# EAGLE design screwshield-idea (EAGLE 5.04)
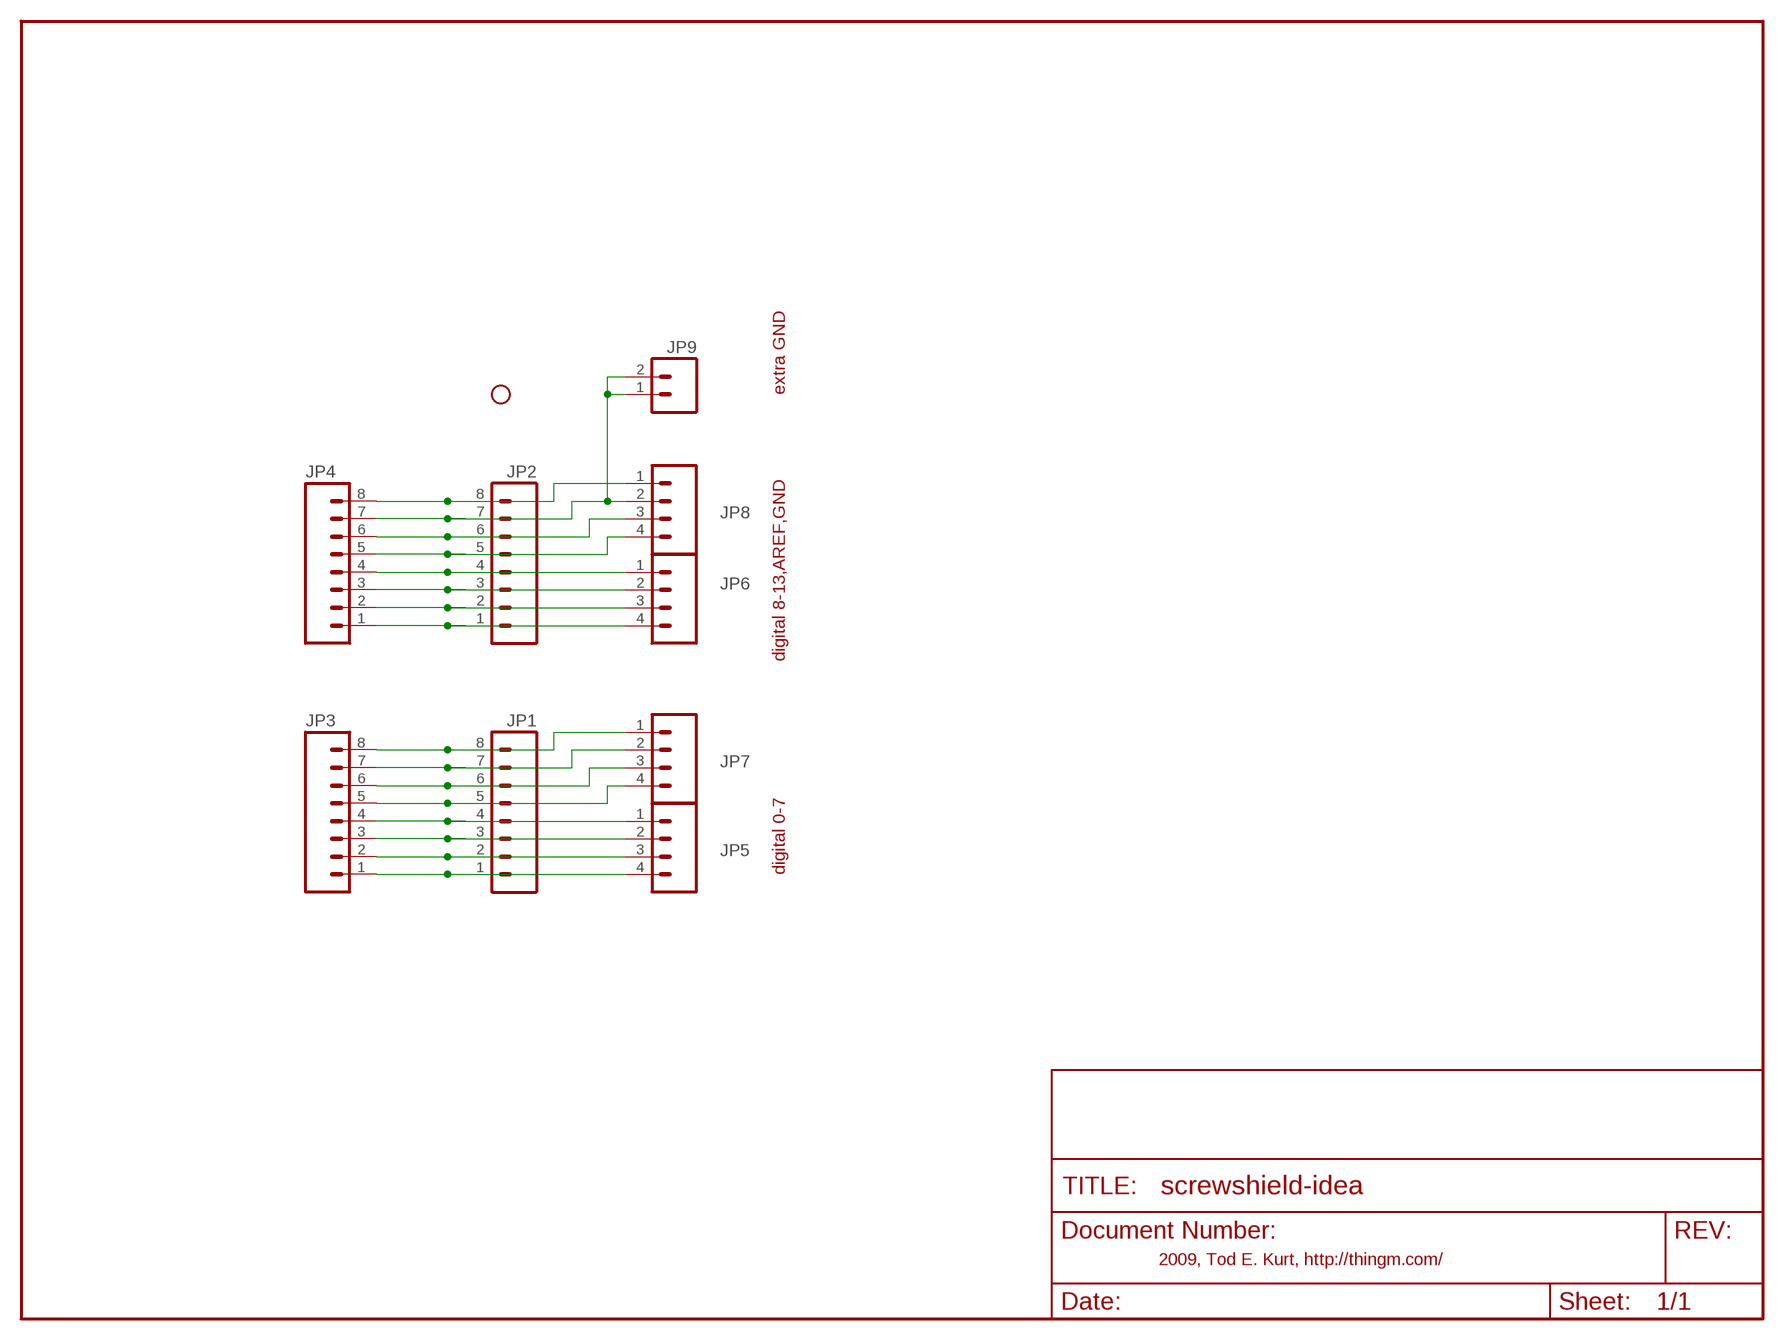
[diagram p0: schematic, sheet 1]

## Parts
JP1  M08LOCK_LONGPADS  [1X08_LOCK_LONGPADS]
JP2  M08LOCK_LONGPADS  [1X08_LOCK_LONGPADS]
JP3  M08LOCK_LONGPADS  [1X08_LOCK_LONGPADS]
JP4  M08LOCK_LONGPADS  [1X08_LOCK_LONGPADS]
JP5  M04SCREW  [SCREWTERMINAL-3.5MM-4]
JP6  M04SCREW  [SCREWTERMINAL-3.5MM-4]
JP7  M04SCREW  [SCREWTERMINAL-3.5MM-4]
JP8  M04SCREW  [SCREWTERMINAL-3.5MM-4]
JP9  M023.5MM  [SCREWTERMINAL-3.5MM-2]
U$1  STAND-OFF  [STAND-OFF]

## Nets
GND: JP2.7 JP4.7 JP8.2 JP9.1 JP9.2
N$1: JP2.8 JP4.8 JP8.1
N$3: JP2.6 JP4.6 JP8.3
N$4: JP2.5 JP4.5 JP8.4
N$5: JP2.4 JP4.4 JP6.1
N$6: JP2.3 JP4.3 JP6.2
N$7: JP2.2 JP4.2 JP6.3
N$8: JP2.1 JP4.1 JP6.4
N$9: JP1.8 JP3.8 JP7.1
N$10: JP1.7 JP3.7 JP7.2
N$11: JP1.6 JP3.6 JP7.3
N$12: JP1.4 JP3.4 JP5.1
N$13: JP1.5 JP3.5 JP7.4
N$14: JP1.3 JP3.3 JP5.2
N$15: JP1.2 JP3.2 JP5.3
N$16: JP1.1 JP3.1 JP5.4

## Notes on the sheet
- extra GND
- digital 8-13,AREF,GND
- digital 0-7
- 2009, Tod E. Kurt, http://thingm.com/

## Library data of the parts
JP1-JP4 = SparkFun-20090108:M08: Header 8 Standard 8-pin 0.1" header. Use with straight break away headers (SKU : PRT-00116), right angle break away headers (PRT-00553), swiss pins (PRT-00743), machine pins (PRT-00117), and female headers (PRT-00115).
JP5-JP8 = SparkFun-20090108:M04: Header 4 Standard 4-pin 0.1" header. Use with straight break away headers (SKU : PRT-00116), right angle break away headers (PRT-00553), swiss pins (PRT-00743), machine pins (PRT-00117), and female headers (PRT-00115). Molex polarized connector foot print use with SKU : PRT-08231 with associated crimp pins and housings.
JP9 = SparkFun-20090108:M02: Header 2 Standard 2-pin 0.1" header. Use with straight break away headers (SKU : PRT-00116), right angle break away headers (PRT-00553), swiss pins (PRT-00743), machine pins (PRT-00117), and female headers (PRT-00115). Molex polarized connector foot print use with SKU : PRT-08233 with associated crimp pins and housings.
U$1 = SparkFun-20090108:STAND-OFF: Stand Off This is the mechanical footprint for a #4 phillips button head screw. Use the keepout ring to avoid running the screw head into surrounding components. SKU : PRT-00447

## Board
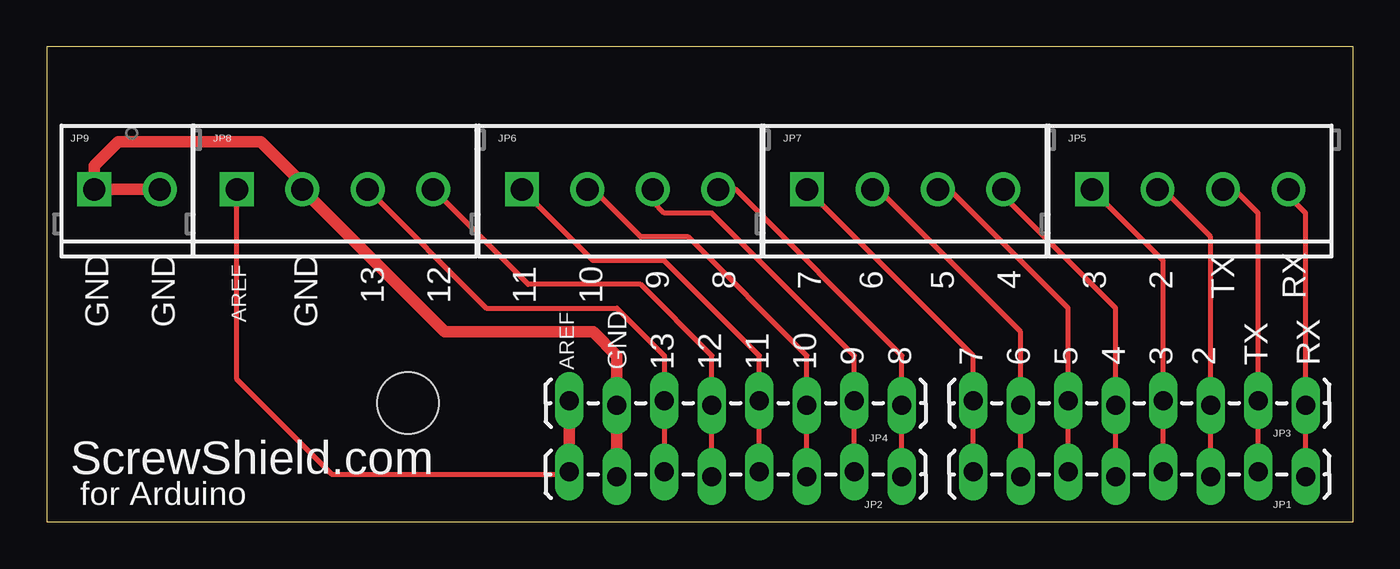
[diagram p1: board, top side]

Size 69.85 x 25.4 mm. Coordinates in mm from the lower left corner, seen from the top.
Outline: 0,0 69.85,0 69.85,25.4 0,25.4 0,0
Copper layers (1*16): Top 0.035mm / dielectric 1.5mm / Bottom 0.035mm
Design rules "default": minimum track width 10mil, minimum drill 24mil, track to track 8mil, track to pad 8mil, pad to pad 8mil, via to via 8mil, smd to smd 8mil, copper to edge 40mil, drill to drill 8mil, minimum pad ring 10mil, minimum via ring 8mil, stop-mask expansion 4mil, vias tented up to drill 0mil, thermal gap 10mil

### Footprints (pad centres in the part's own frame; a part is rotated, then mirrored left to right if it is on the bottom)
1X08_LOCK_LONGPADS = drill 1.016 long: 1 0,0.127; 2 2.54,-0.127; 3 5.08,0.127; 4 7.62,-0.127; 5 10.16,0.127; 6 12.7,-0.127; 7 15.24,0.127; 8 17.78,-0.127
SCREWTERMINAL-3.5MM-4 = drill 1.2 square: 1 0,0 | drill 1.2 round: 2 3.5,0; 3 7,0; 4 10.5,0
SCREWTERMINAL-3.5MM-2 = drill 1.2 square: 1 0,0 | drill 1.2 round: 2 3.5,0
STAND-OFF = hole 3.302: 0,0

### Placement (x,y rotation side)
JP1  67.31,2.54 180 top
JP2  45.72,2.54 180 top
JP3  67.31,6.35 180 top
JP4  45.72,6.35 180 top
JP5  55.88,17.78 0 top
JP6  25.4,17.78 0 top
JP7  40.64,17.78 0 top
JP8  10.16,17.78 0 top
JP9  2.54,17.78 0 top
U$1  19.3,6.35 0 top

### Tracks (layer width: path | path; a pad name or v marks a point on that pad's centre or on a via)
GND
  Top 0.254: JP8.2 13.97,17.78
  Top 0.61: JP9.2 JP9.1 2.54,19.05 3.81,20.32 11.43,20.32 13.66,18.09 JP8.2 21.28,10.16 29.21,10.16 30.48,8.89 JP4.7 JP2.7
N$1
  Top 0.254: 27.94,2.54 JP2.8 27.81,2.54 15.24,2.54 10.16,7.62 JP8.1
  Top 0.61: JP2.8 JP4.8
N$3
  Top 0.254: JP2.6 JP4.6 33.02,8.89 30.48,11.43 23.51,11.43 JP8.3
N$4
  Top 0.254: JP2.5 JP4.5 35.56,8.89 31.75,12.7 25.74,12.7 JP8.4
N$5
  Top 0.254: JP2.4 JP4.4 38.1,8.89 33.02,13.97 29.21,13.97 JP6.1
N$6
  Top 0.254: JP2.3 JP4.3 40.64,8.89 34.29,15.24 31.75,15.24 29.21,17.78 JP6.2
N$7
  Top 0.254: JP2.2 JP4.2 43.18,8.89 35.56,16.51 33.02,16.51 32.4,17.13 JP6.3
N$8
  Top 0.254: JP2.1 JP4.1 45.72,8.89 36.83,17.78 JP6.4
N$9
  Top 0.254: JP1.8 JP3.8 49.53,8.89 JP7.1
N$10
  Top 0.254: JP1.7 JP3.7 52.07,10.16 44.45,17.78 JP7.2
N$11
  Top 0.254: JP1.6 JP3.6 54.61,11.43 48.26,17.78 JP7.3
N$12
  Top 0.254: JP1.4 JP3.4 59.69,13.97 JP5.1
N$13
  Top 0.254: JP1.5 JP3.5 57.15,11.43 50.8,17.78 JP7.4
N$14
  Top 0.254: JP1.3 JP3.3 62.23,15.24 59.69,17.78 JP5.2
N$15
  Top 0.254: JP1.2 JP3.2 64.77,16.51 63.5,17.78 JP5.3
N$16
  Top 0.254: JP1.1 JP3.1 67.31,16.51 66.04,17.78 JP5.4

### Text on the board
tPlace: 13 | 12 | 11 | 10 | 9 | 8 | 7 | 6 | 5 | 4 | 3 | 2 | TX | RX | AREF | GND | GND | GND | AREF | GND | 13 | 12 | 11 | 10 | 9 | 8 | 7 | 6 | 5 | 4 | 3 | 2 | TX | RX | ScrewShield.com | for Arduino